# EAGLE design Fathom-E (EAGLE 7.4.0)
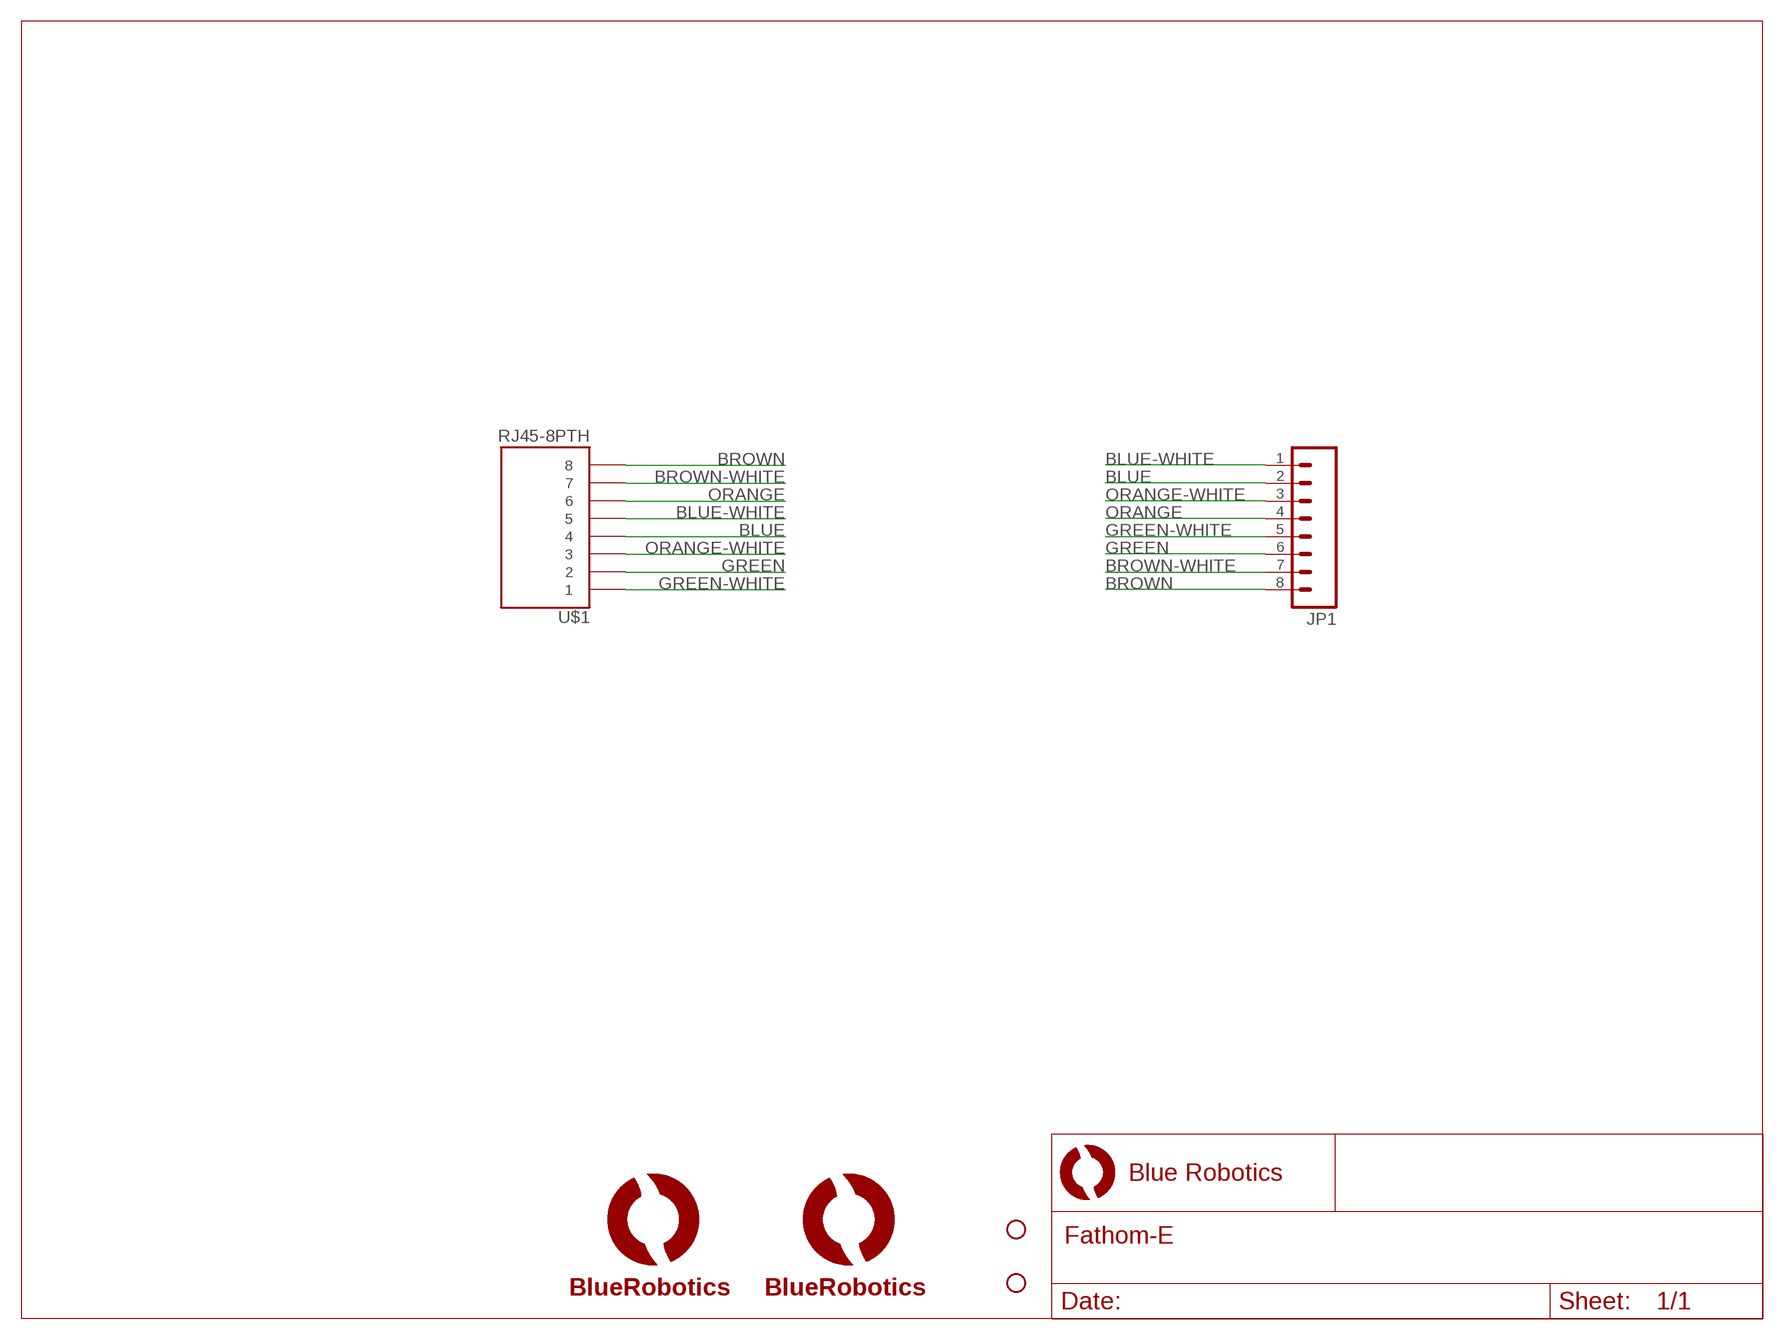
[diagram p0: schematic, sheet 1]

## Parts
JP1  M083.5MM-8  [SCREWTERMINAL-3.5MM-8]
STANDOFF2  STAND-OFF  [STAND-OFF]
STANDOFF3  STAND-OFF  [STAND-OFF]
U$1  RJ45-8PTH  [RJ45-8]
U$6  LOGOBR-LOGO-MS-COPPER  [BR-LOGO-MEDIUM-SMALL-COPPER]
U$7  LOGOFULL-M  [BR-FULL-LOGO-MEDIUM]

## Nets
BLUE: JP1.2 U$1.4
BLUE-WHITE: JP1.1 U$1.5
BROWN: JP1.8 U$1.8
BROWN-WHITE: JP1.7 U$1.7
GREEN: JP1.6 U$1.2
GREEN-WHITE: JP1.5 U$1.1
ORANGE: JP1.4 U$1.6
ORANGE-WHITE: JP1.3 U$1.3

## Library data of the parts
JP1 = SparkFun-Connectors:M08: Header 8 Standard 8-pin 0.1" header. Use with straight break away headers (SKU : PRT-00116), right angle break away headers (PRT-00553), swiss pins (PRT-00743), machine pins (PRT-00117), and female headers (PRT-00115).
STANDOFF2 STANDOFF3 = SparkFun-Electromechanical:STAND-OFF: #4 Stand Off This is the mechanical footprint for a #4 phillips button head screw. Use the keepout ring to avoid running the screw head into surrounding components. SKU : PRT-00447
U$1 = SparkFun-Connectors:RJ45-8: RJ45 Jack Simple RJ45, 8-pin connection - connector for common Cat5, Cat5e, and Cat6 Ethernet cables. Footprint not yet proven in production. Connector sku is PRT-00643; Breakout PCB sku is BOB-00716.
U$6 U$7 = BlueRobotics-Main:LOGO

## Board
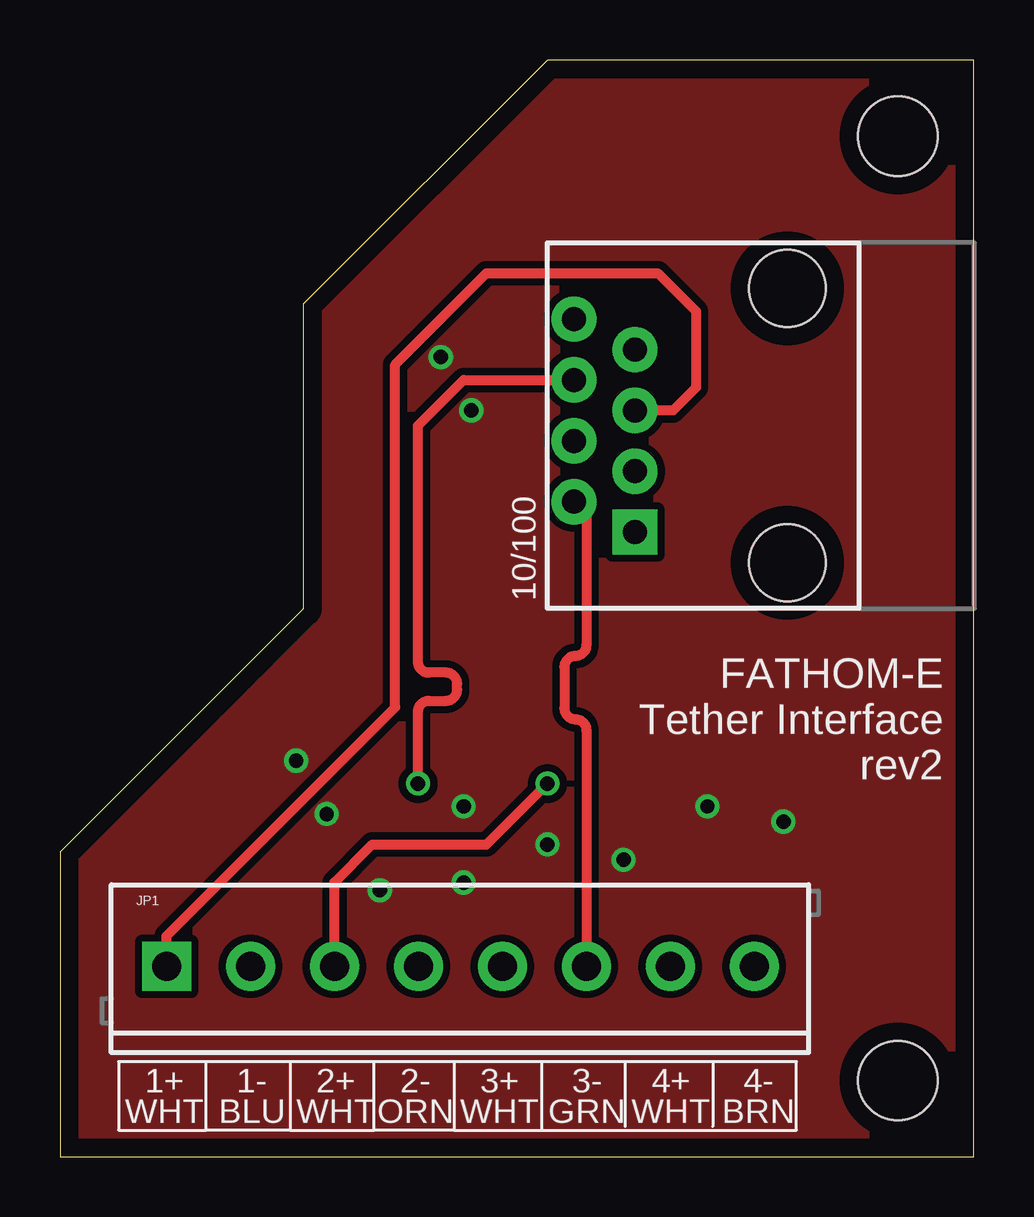
[diagram p1: board, top side]
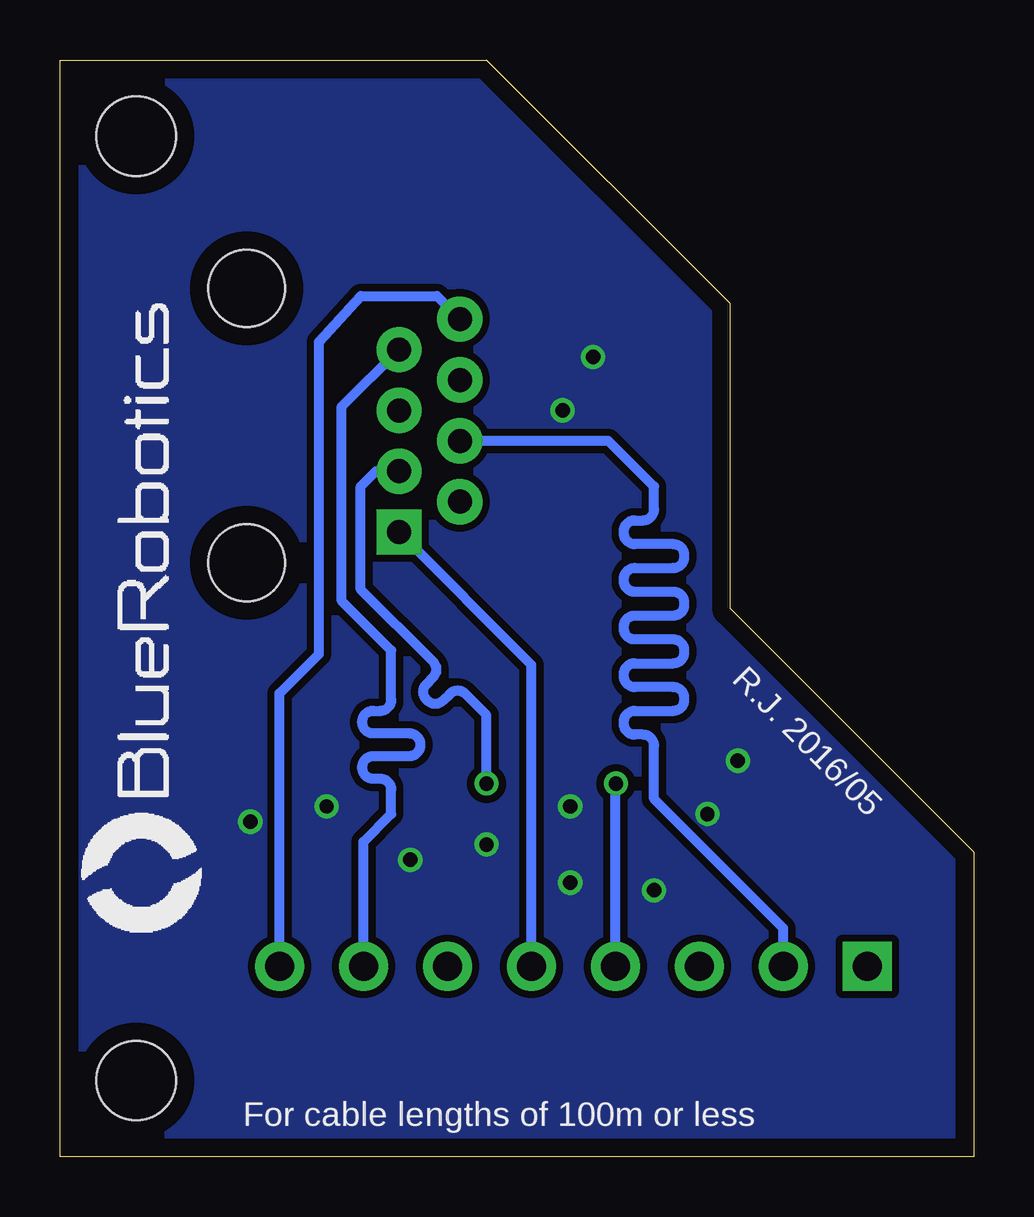
[diagram p2: board, bottom side, seen from below]

Size 38.1 x 45.72 mm. Coordinates in mm from the lower left corner, seen from the top.
Outline: 0,0 38.1,0 38.1,45.72 20.32,45.72 10.16,35.56 10.16,22.86 0,12.7 0,0
Copper layers (1*16): Top 0.035mm / dielectric 1.5mm / Bottom 0.035mm
Design rules "default *": minimum track width 10mil, minimum drill 13mil, track to track 8mil, track to pad 8mil, pad to pad 8mil, via to via 8mil, smd to smd 8mil, copper to edge 30mil, drill to drill 8mil, minimum pad ring 10mil, minimum via ring 8mil, stop-mask expansion 4mil, vias tented up to drill 30mil, thermal gap 10mil

### Footprints (pad centres in the part's own frame; a part is rotated, then mirrored left to right if it is on the bottom)
SCREWTERMINAL-3.5MM-8 = drill 1.2 pad 2.032 square: 1 0,0 | drill 1.2 pad 2.032: 2 3.5,0; 3 7,0; 4 10.5,0; 5 14,0; 6 17.5,0; 7 21,0; 8 24.5,0
STAND-OFF = hole 3.302: 0,0
RJ45-8 = drill 1 pad 1.88 square: 1 -4.445,6.35 | drill 1 pad 1.88: 2 -3.175,8.89; 3 -1.905,6.35; 4 -0.635,8.89; 5 0.635,6.35; 6 1.905,8.89; 7 3.175,6.35; 8 4.445,8.89 | hole 3.2: -5.715,0; 5.715,0

### Placement (x,y rotation side)
JP1  4.45,7.94 0 top
STANDOFF2  34.92,3.17 0 top
STANDOFF3  34.92,42.55 0 top
U$1  RJ45-8PTH-H  [RJ45-8]  30.32,30.48 90 top
U$6  20,39.37 0 top
U$7  30.8,7.3 90 bottom

### Tracks (layer width: path | path; a pad name or v marks a point on that pad's centre or on a via)
BLUE
  Bottom 0.406: JP1.2 7.95,9.53 13.34,14.92 13.34,17.14 arc-90 13.79,17.6 14.14,17.6 arc90 14.6,18.05 14.6,18.13 arc90 14.14,18.59 12.53,18.59 arc-90 12.07,19.05 12.07,19.12 arc-90 12.53,19.58 14.14,19.58 arc90 14.6,20.04 14.6,20.12 arc90 14.14,20.57 12.53,20.57 arc-90 12.07,21.03 12.07,21.11 arc-90 12.53,21.57 14.14,21.57 arc90 14.6,22.02 14.6,22.1 arc90 14.14,22.56 12.53,22.56 arc-90 12.07,23.02 12.07,23.09 arc-90 12.53,23.55 14.14,23.55 arc90 14.6,24.01 14.6,24.09 arc90 14.14,24.55 12.53,24.55 arc-90 12.07,25 12.07,25.08 arc-90 12.53,25.54 14.14,25.54 arc90 14.6,26 14.6,26.07 arc90 14.14,26.53 13.79,26.53 arc-90 13.34,26.99 13.34,27.94 15.24,29.84 U$1.4
BLUE-WHITE
  Top 0.406: JP1.1 4.45,9.21 13.97,18.73 13.97,33.02 17.78,36.83 24.92,36.83 26.51,35.24 26.51,32.07 25.56,31.11 U$1.5
BROWN
  Bottom 0.406: JP1.8 28.95,19.32 27.3,20.95 27.3,33.97 25.56,35.88 22.38,35.88 U$1.8
BROWN-WHITE
  Bottom 0.406: JP1.7 25.45,13.13 24.29,14.29 24.29,15.3 arc-90 24.75,15.76 25.04,15.76 arc90 25.5,16.21 25.5,16.25 arc90 25.04,16.7 23.53,16.7 arc-90 23.08,17.16 23.08,17.19 arc-90 23.53,17.65 25.04,17.65 arc90 25.5,18.11 25.5,18.14 arc90 25.04,18.59 24.75,18.59 arc-90 24.29,19.05 24.29,21.11 26.35,23.18 26.35,31.27 U$1.7
GND  (via drill 0.6)
  other vias: 26.99,14.61 23.5,12.38 20.32,13.02 16.83,14.61 16.83,11.43 11.11,14.29 13.34,11.11 9.84,16.51 30.16,13.97 17.14,31.11 15.88,33.34
  pour Top (isolate 0.305): -2.54,0 -2.54,25.4 20.32,48.26 40.64,48.26 40.64,0
  pour Bottom (isolate 0.305): 0,-2.54 0,25.4 20.32,45.72 38.1,45.72 38.1,-2.54
GREEN
  Top 0.406: JP1.6 21.95,17.78 arc90 21.49,18.24 arc-90 21.03,18.69 21.03,20.42 arc-90 21.49,20.88 arc90 21.95,21.33 21.95,26.79 U$1.2
GREEN-WHITE
  Bottom 0.406: JP1.5 18.45,20.51 U$1.1
ORANGE  (via drill 0.6)
  Top 0.406: U$1.6 16.83,32.38 14.92,30.48 14.92,20.64 arc90 15.38,20.18 16.1,20.18 arc-90 16.55,19.72 16.55,19.46 arc-90 16.1,19.01 15.38,19.01 arc90 14.92,18.55 v14.92,15.56
  Bottom 0.406: JP1.4 14.95,15.54 v14.92,15.56
ORANGE-WHITE  (via drill 0.6)
  Top 0.406: JP1.3 11.45,11.45 13.02,13.02 17.78,13.02 v20.32,15.56
  Bottom 0.406: v20.32,15.56 20.32,18.41 21.2,19.3 arc-90 21.85,19.3 22.13,19.02 arc90 22.78,19.02 22.82,19.06 arc90 22.82,19.71 22.54,19.99 arc-90 22.54,20.64 25.56,23.65 25.56,27.94 24.92,28.57 U$1.3

### Text on the board
tPlace: 10/100 | FATHOM-E / Tether Interface / rev2 | 1+ / WHT | 1- / BLU | 2+ / WHT | 2- / ORN | 3+ / WHT | 3- / GRN | 4+ / WHT | 4- / BRN
bPlace: R.J. 2016/05 | For cable lengths of 100m or less